# Altium schematic sheet digital.SchDoc
size A4
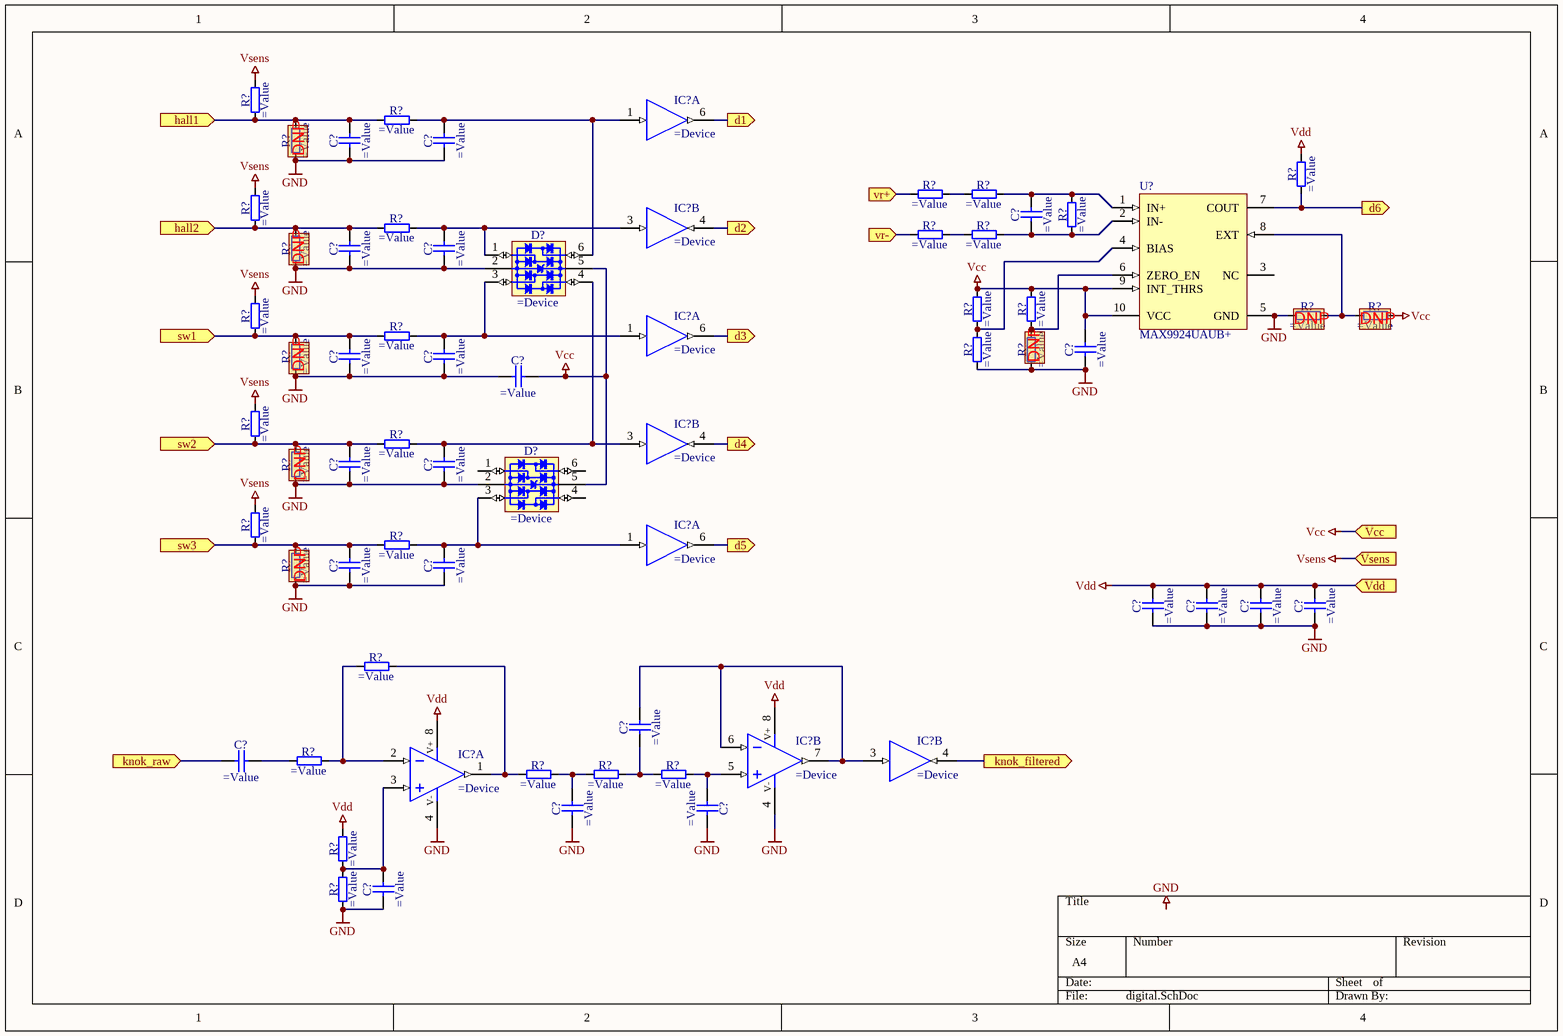
[diagram p0: digital.SchDoc]

## Parts
(Parts that share a designator on the sheet are numbered #1, #2 ... from top to bottom, then left to right.)
C?#1  (no value)
C?#2  (no value)
C?#3  (no value)
C?#4  (no value)
C?#5  (no value)
C?#6  (no value)
C?#7  (no value)
C?#8  (no value)
C?#9  (no value)
C?#10  (no value)
C?#11  (no value)
C?#12  (no value)
C?#13  (no value)
C?#14  (no value)
C?#15  (no value)
C?#16  (no value)
C?#17  (no value)
C?#18  (no value)
C?#19  (no value)
C?#20  (no value)
C?#21  (no value)
C?#22  (no value)
D?#1  (no value)
D?#2  (no value)
IC?#1  (no value)  (part A of 2)
IC?#2  (no value)  (part B of 2)
IC?#3  (no value)  (part A of 2)
IC?#4  (no value)  (part B of 2)
IC?#5  (no value)  (part A of 2)
IC?#6  (no value)  (part B of 2)
IC?#7  (no value)  (part B of 2)
IC?#8  (no value)  (part A of 2)
R?#1  (no value)
R?#2  (no value)
R?#3  (no value)
R?#4  (no value)
R?#5  (no value)
R?#6  (no value)
R?#7  (no value)
R?#8  (no value)
R?#9  (no value)
R?#10  (no value)
R?#11  (no value)
R?#12  (no value)
R?#13  (no value)
R?#14  (no value)
R?#15  (no value)
R?#16  (no value)
R?#17  (no value)
R?#18  (no value)
R?#19  (no value)
R?#20  (no value)
R?#21  (no value)
R?#22  (no value)
R?#23  (no value)
R?#24  (no value)
R?#25  (no value)
R?#26  (no value)
R?#27  (no value)
R?#28  (no value)
R?#29  (no value)
R?#30  (no value)
R?#31  (no value)
R?#32  (no value)
R?#33  (no value)
R?#34  (no value)
U?  MAX9924UAUB+  [MAXM-U10+2_L]

## Ports
d1 (out), d2 (out), d3 (out), d4 (out), d5 (out), d6 (out), hall1 (in), hall2 (in), knok_filtered (out), knok_raw (in), sw1 (in), sw2 (in), sw3 (in), Vcc (in), Vdd (in), vr+ (in), vr- (in), Vsens (in)

## Nets
GND: C?#1.1 C?#2.1 C?#4.1 C?#5.1 C?#6.1 C?#7.1 C?#8.1 C?#9.1 C?#10.1 C?#11.1 C?#12.1 C?#13.1 C?#14.1 C?#15.1 C?#16.1 C?#17.1 C?#20.2 C?#21.1 C?#22.1 D?#1.2(GND) D?#2.2(GND) IC?#1.2(GND) IC?#2.2(GND) IC?#3.2(GND) IC?#4.2(GND) IC?#5.2(GND) IC?#6.4(V-) IC?#7.2(GND) IC?#8.4(V-) R?#3.1 R?#12.1 R?#13.1 R?#19.1 R?#20.1 R?#21.1 R?#24.1 R?#27.1 R?#34.1 U?.5(GND)
Vcc: C?#6.2 C?#9.2 D?#1.5(VBUS) D?#2.5(VBUS) R?#14.2 R?#15.2 R?#16.2 U?.9(INT_THRS) U?.10(VCC) ; port Vcc
Vdd: C?#14.2 C?#15.2 C?#16.2 C?#17.2 IC?#1.5(Vdd) IC?#2.5(Vdd) IC?#3.5(Vdd) IC?#4.5(Vdd) IC?#5.5(Vdd) IC?#6.8(V+) IC?#7.5(Vdd) IC?#8.8(V+) R?#6.2 R?#33.2 ; port Vdd
Vsens: R?#1.2 R?#7.2 R?#17.2 R?#22.2 R?#25.2 ; port Vsens
d1: IC?#1.6(OUT) ; port d1
d2: IC?#2.4(OUT) ; port d2
d3: IC?#3.6(OUT) ; port d3
d4: IC?#4.4(OUT) ; port d4
d5: IC?#5.6(OUT) ; port d5
d6: R?#6.1 U?.7(COUT) ; port d6
hall1: C?#1.2 R?#1.1 R?#2.1 R?#3.2 ; port hall1
hall2: C?#4.2 R?#7.1 R?#8.1 R?#12.2 ; port hall2
knok_filtered: IC?#7.4(OUT) ; port knok_filtered
knok_raw: C?#19.1 ; port knok_raw
sw1: C?#7.2 R?#17.1 R?#18.1 R?#21.2 ; port sw1
sw2: C?#10.2 R?#22.1 R?#23.1 R?#24.2 ; port sw2
sw3: C?#12.2 R?#25.1 R?#26.1 R?#27.2 ; port sw3
vr+: R?#4.1 ; port vr+
vr-: R?#9.1 ; port vr-
NetC?#2_2: C?#2.2 D?#1.6(I/O4) IC?#1.1(IN) R?#2.2
NetC?#3_1: C?#3.1 R?#10.2 R?#11.1 U?.2(IN-)
NetC?#3_2: C?#3.2 R?#5.2 R?#11.2 U?.1(IN+)
NetC?#5_2: C?#5.2 D?#1.1(I/O1) IC?#2.3(IN) R?#8.2
NetC?#8_2: C?#8.2 D?#1.3(I/O2) IC?#3.1(IN) R?#18.2
NetC?#11_2: C?#11.2 D?#1.4(I/O3) IC?#4.3(IN) R?#23.2
NetC?#13_2: C?#13.2 D?#2.3(I/O2) IC?#5.1(IN) R?#26.2
NetC?#18_1: C?#18.1 R?#31.2 R?#32.1
NetC?#18_2: C?#18.2 IC?#6.6(IN-) IC?#6.7(OUT) IC?#7.3(IN)
NetC?#19_2: C?#19.2 R?#29.1
NetC?#20_1: C?#20.1 IC?#6.5(IN+) R?#32.2
NetC?#21_2: C?#21.2 R?#30.2 R?#31.1
NetC?#22_2: C?#22.2 IC?#8.3(IN+) R?#33.1 R?#34.2
NetIC?#8_1: IC?#8.1(OUT) R?#28.2 R?#30.1
NetIC?#8_2: IC?#8.2(IN-) R?#28.1 R?#29.2
NetR?#4_2: R?#4.2 R?#5.1
NetR?#9_2: R?#9.2 R?#10.1
NetR?#13_2: R?#13.2 R?#14.1 U?.8(EXT)
NetR?#15_1: R?#15.1 R?#19.2 U?.4(BIAS)
NetR?#16_1: R?#16.1 R?#20.2 U?.6(ZERO_EN)

Not connected (* = marked no-connect by the designer): D?#2 1(I/O1) 4(I/O3) 6(I/O4); U? 3(NC)

## Notes on the sheet
- (near R?#3) DNP
- (near R?#12) DNP
- (near R?#21) DNP
- (near R?#20) DNP
- (near R?#13) DNP
- (near R?#14) DNP
- (near R?#24) DNP
- (near R?#27) DNP
- Labels drawn without touching a wire or pin: GND

## Library data of the parts
C?#1-C?#22 = Capacitor - non polarized: Non-polarised capacitor
D?#1 D?#2 = SRV05-4: RailClamps Low Capacitance TVS Diode Array
IC?#1-IC?#5 IC?#7 = 742G17: Dual Schmitt-Trigger Buffer
IC?#6 IC?#8 = Operational Amplifier x2 Type1: Dual Operational Amplifier
R?#1-R?#34 = Resistor
U? = MAX9924UAUB+: Single-Channel, Variable Reluctance Sensor Interface with No Low Power Shutdown, 4.5 to 5.5 V, -40 to 125 degC, 10-Pin SOP (U10+2), Pb-Free; Industry Qualified: Automotive - AECQ100, Automotive - General; Channels: 1; ComponentLink1Description: Manufacturer URL; ComponentLink2Description: Datasheet; DatasheetVersion: Rev. 4; Generic Part Number: MAX9924; Low Pwr. Shutdn: No; ComponentLink3URL: http://pdfserv.maximintegrated.com/package_dwgs/21-0061.PDF; ComponentLink3Description: Package Specification; ComponentLink1URL: http://www.maximintegrated.com/; ComponentLink2URL: http://datasheets.maximintegrated.com/en/ds/MAX9924-MAX9927.pdf; Code_JEDEC: MO-187; PackageVersion: Rev. L, 07/2008; PartNumber: MAX9924UAUB+; PackageDescription: 10-Pin Micro-MAX, Thin Shrink Small-Outline (U10+2), Body 3 x 3 mm, Pitch 0.5 mm; Mounting Technology: Surface Mount; PackageReference: U10+2